# EAGLE design DC-DC (EAGLE 7.6.0)
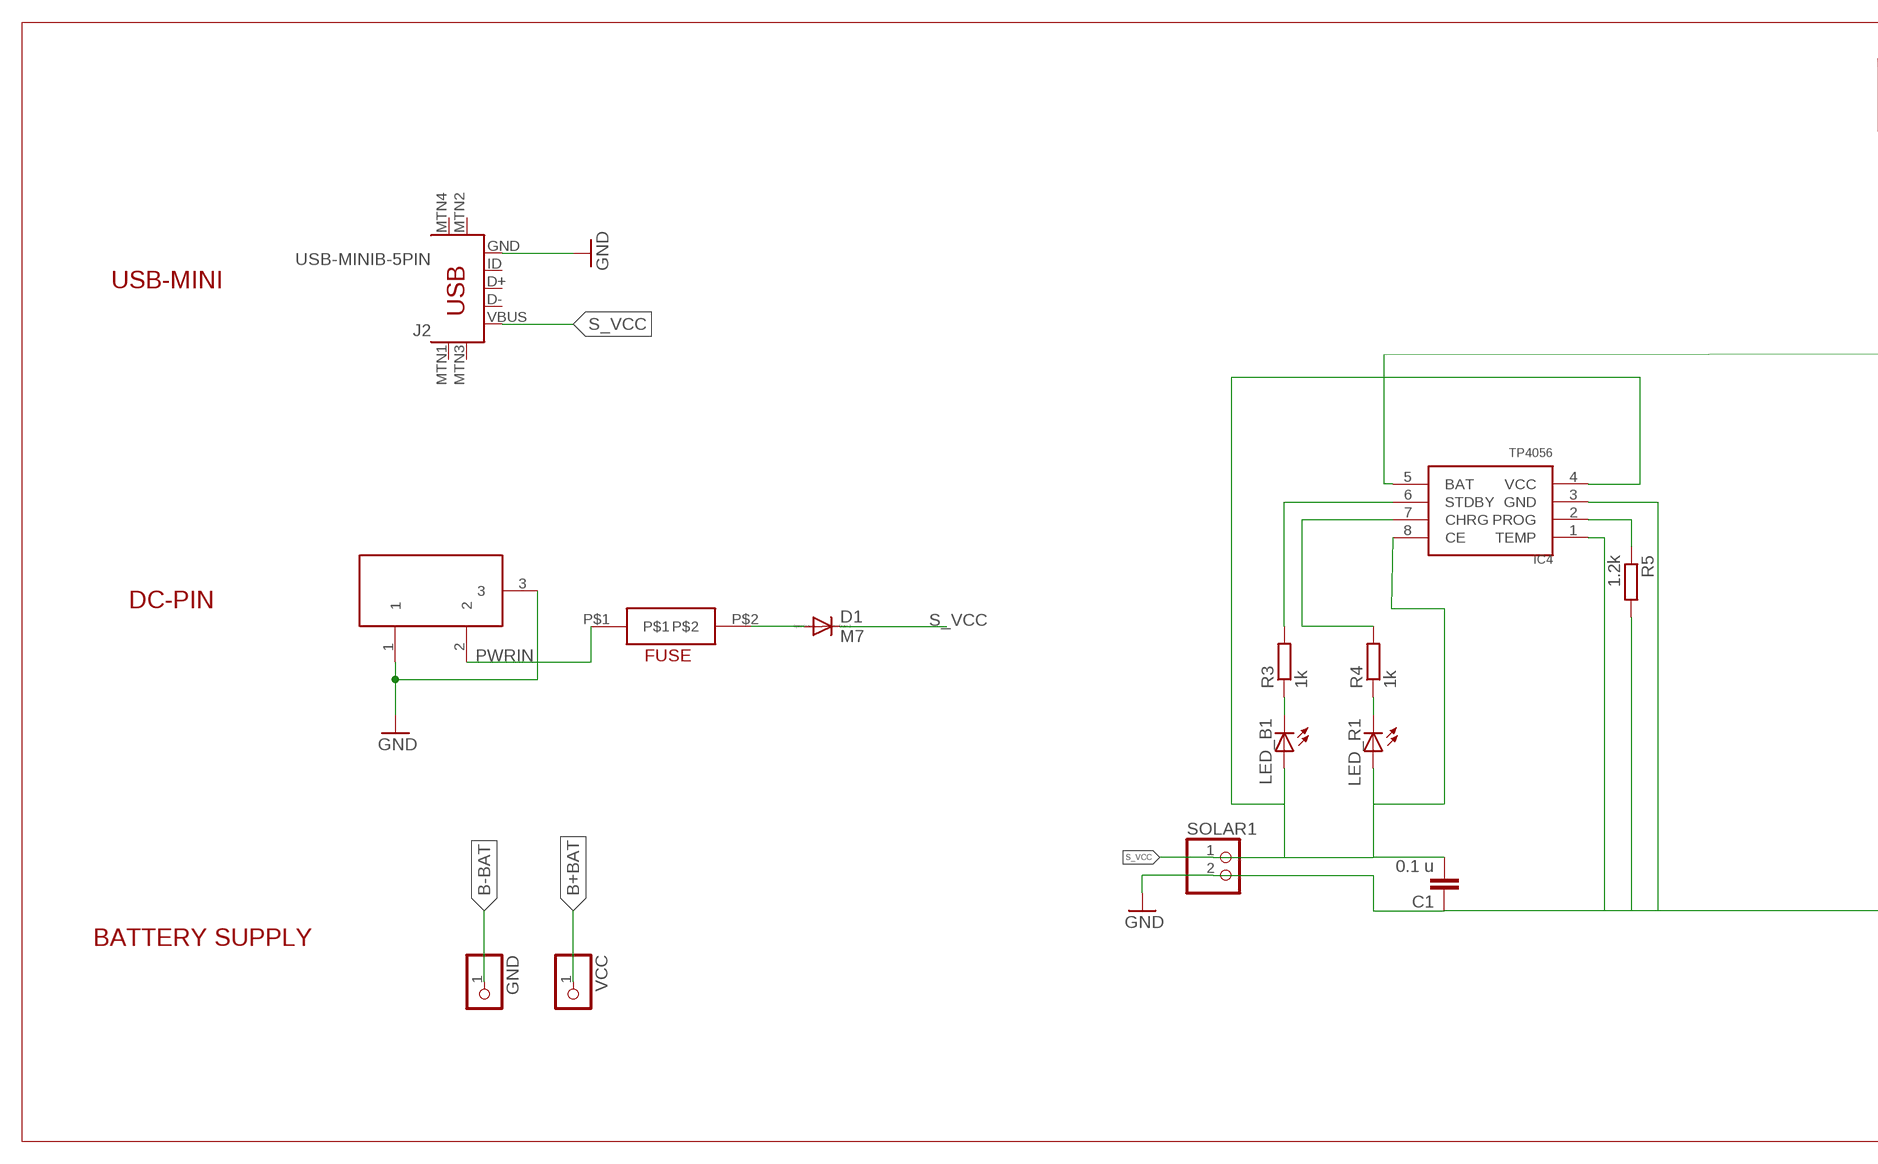
[diagram p0: schematic, sheet 1, part 1 of 2]
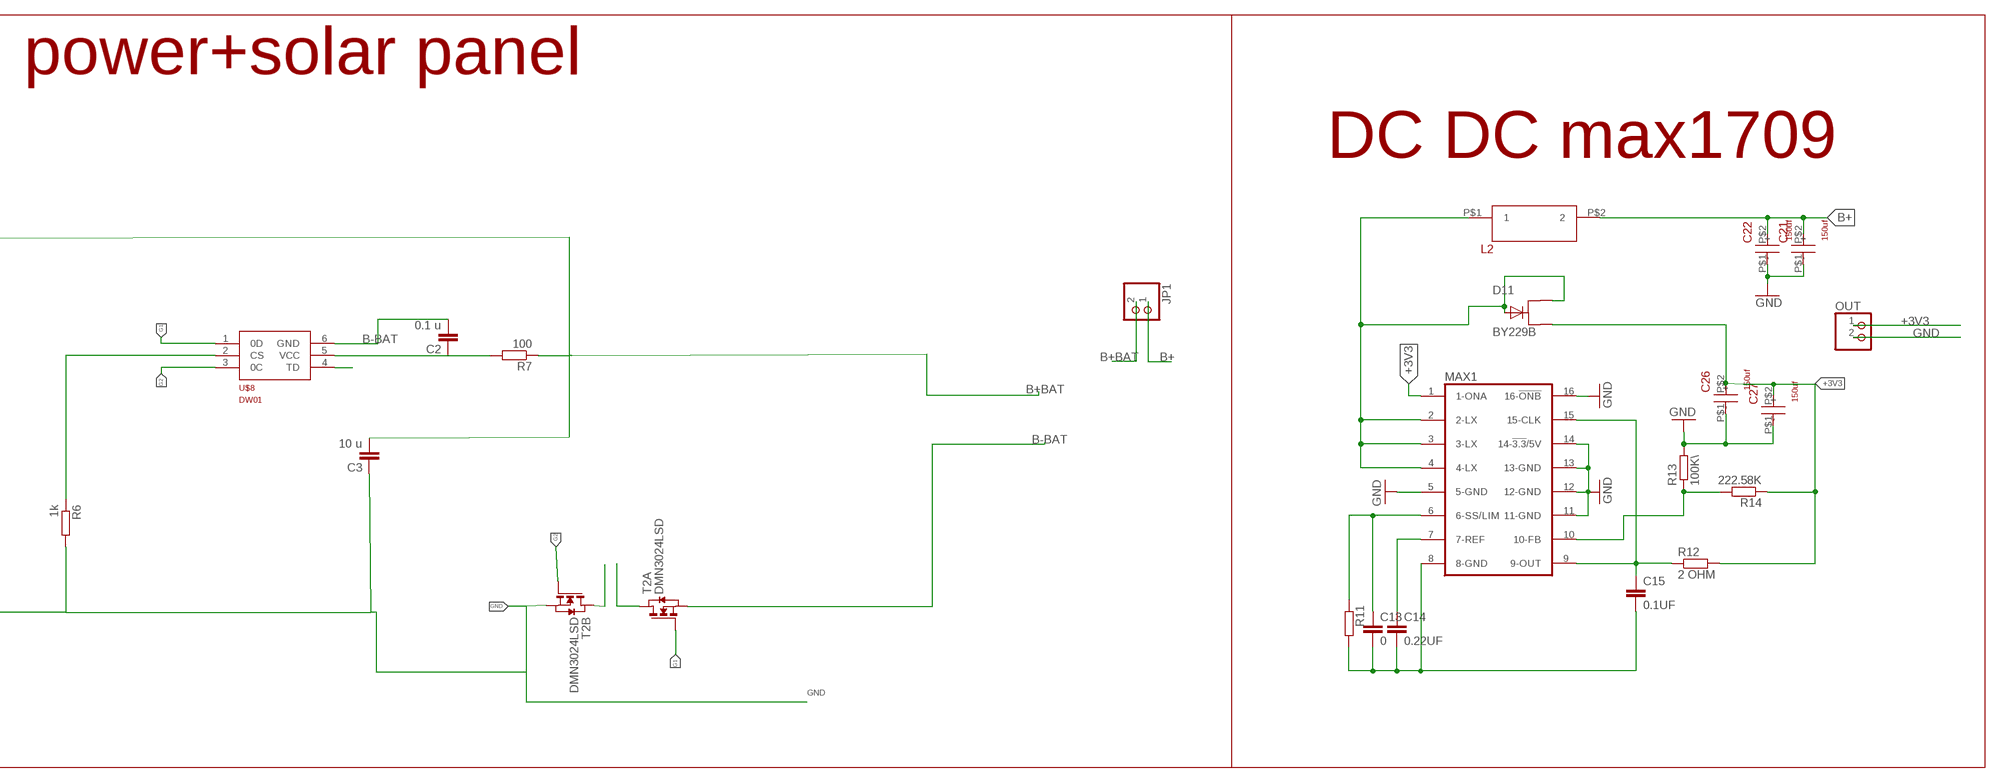
[diagram p1: schematic, sheet 1, part 2 of 2]

## Parts
C1  0.1 u  C-EUC0805  [C0805]
C2  0.1 u  C-EUC0805  [C0805]
C3  10 u  C-EUC0805  [C0805]
C13  0  C-EUC0805  [C0805]
C14  0.22UF  C-EUC0805  [C0805]
C15  0.1UF  C-EUC0805  [C0805]
C21  150uf  MOSHE_CAP  [CAP]
C22  150uf  MOSHE_CAP  [CAP]
C26  150uf  MOSHE_CAP  [CAP]
C27  150uf  MOSHE_CAP  [CAP]
D1  M7  DIODE-SMB  [SMB]
D11  BY229B  [TO263AB]
GND  PINHD-1X1  [1X01]
IC4  TP4056  [SOP-8]
J2  USB-MINIB-5PIN  [USB-MINIB]
JP1  PINHD-1X2  [1X02]
L2  INDUCTOR  [INDUCTOR_150]
LED_B1  LEDCHIP-LED0805  [CHIP-LED0805]
LED_R1  LEDCHIP-LED0805  [CHIP-LED0805]
MAX1  MOSHE_MAX1709F  [MAX1709]
OUT  PINHD-1X2  [1X02]
R3  1k  R-EU_R0805  [R0805]
R4  1k  R-EU_R0805  [R0805]
R5  1.2k  R-EU_R0805  [R0805]
R6  1k  R-EU_R0805  [R0805]
R7  100  R-EU_R0805  [R0805]
R11  R-EU_R0805  [R0805]
R12  2 OHM  R-EU_R0805  [R0805]
R13  100K\  R-EU_R0805  [R0805]
R14  222.58K  R-EU_R0805  [R0805]
SOLAR1  PINHD-1X2  [1X02]
T2  DMN3024LSD  [TSSOP-8]
U$5  FUSE_M  [DIP2]
U$8  DW01  [SOT23-6]
VCC  PINHD-1X1  [1X01]
X1  DC21MMX  [DC-21MM]

## Nets
+3V3: C26.P$2(-) C27.P$2(-) D11.K MAX1.1(1-ONA) OUT.1 R12.2 R14.1
B+: C21.P$2(-) C22.P$2(-) JP1.1 L2.P$2
B+BAT: C3.2 IC4.5(BAT) JP1.2 R7.1 VCC.1
B-BAT: C2.2 GND.1 T2.2(A:S) T2.3(A:S) U$8.6(GND)
G1: T2.4(A:G) U$8.1(0D)
G2: T2.5(B:G) U$8.3(0C)
GND: C1.1 C3.1 C13.2 C14.2 C15.2 C21.P$1(+) C22.P$1(+) C26.P$1(+) C27.P$1(+) IC4.1(TEMP) IC4.3(GND) J2.GND MAX1.5(5-GND) MAX1.8(8-GND) MAX1.11(11-GND) MAX1.12(12-GND) MAX1.13(13-GND) MAX1.14(14-!3.3!/5V) MAX1.16(16-!ONB!) OUT.2 R5.2 R6.2 R11.2 R13.2 SOLAR1.2 T2.6(B:S) T2.7(B:S) X1.1 X1.3
N$3: LED_B1.C R3.1
N$4: LED_R1.C R4.1
N$5: D1.A U$5.P$2
N$10: IC4.6(STDBY) R3.2
N$12: C13.1 MAX1.6(6-SS/LIM) R11.1
N$13: C14.1 MAX1.7(7-REF)
N$23: IC4.7(CHRG) R4.2
N$24: IC4.2(PROG) R5.1
N$29: U$8.4(TD)
N$30: R6.1 U$8.2(CS)
N$36: C2.1 R7.2 U$8.5(VCC)
N$39: T2.8(B:D)
N$40: T2.1(A:D)
N$42: C15.1 MAX1.9(9-OUT) MAX1.15(15-CLK) R12.1
N$43: MAX1.10(10-FB) R13.1 R14.2
N$44: D11.1 D11.2 L2.P$1 MAX1.2(2-LX) MAX1.3(3-LX) MAX1.4(4-LX)
PWRIN: U$5.P$1 X1.2
S_VCC: C1.2 D1.C IC4.4(VCC) IC4.8(CE) J2.VBUS LED_B1.A LED_R1.A SOLAR1.1
Unconnected: J2.D+ J2.D- J2.ID J2.MTN1(MTN2) J2.MTN2(MTN3) J2.MTN3(MTN1) J2.MTN4

## Notes on the sheet
- power+solar panel
- DC DC max1709
- USB-MINI
- DC-PIN
- BATTERY SUPPLY

## Library data of the parts
C1-C3 C13-C15 = rcl:C-EU: CAPACITOR, European symbol
C21 C22 C26 C27 = tantalum capacitor:MOSHE_CAP
D1 = diode:DIODE-: DIODE
D11 = diode:BY229B: DIODE Fast Switching Rectifier, 8A (Vishay)
GND VCC = pinhead:PINHD-1X1: PIN HEADER
IC4 = TP4056:TP4056
J2 = SparkFun-Connectors:USB-MINIB: Mini-USB "B" connector with 5th pin broken out. Created new symbol breaking out 5th "ID" pin in mini/micro USB connector spec. See: http://en.wikipedia.org/wiki/Mini_usb#Cables. Uses same footprint as 4-pin symbol. Also added pins to connect to mounting / shield pads if required (probably not generally needed as signals aren't shielded once they leave the connector).; PROD_ID: CONN-08193
JP1 OUT SOLAR1 = pinhead:PINHD-1X2: PIN HEADER
L2 = MOSHE_DIODE.SS54:INDUCTOR
LED_B1 LED_R1 = adafruit:LED: LED OSRAM: - CHIPLED LG R971, LG N971, LY N971, LG Q971, LY Q971, LO R971, LY R971 LH N974, LH R974 LS Q976, LO Q976, LY Q976 LO Q996 - Hyper CHIPLED LW Q18S LB Q993, LB Q99A, LB R99A - SideLED LS A670, LO A670, LY A670, LG A670, LP A670 LB A673, LV A673, LT A673, LW A673 LH A674 LY A675 LS A676, LA A676, LO A676, LY A676, LW A676 LS A679, LY A679, LG A679 - Hyper Micro SIDELED® LS Y876, LA Y876, LO Y876, LY Y876 LT Y87S - SmartLED LW L88C, LW L88S LB L89C, LB L89S, LG L890 LS L89K, LO L89K, LY L89K LS L896, LA L896, LO L896, LY L896 - TOPLED LS T670, LO T670, LY T670, LG T670, LP T670 LSG T670, LSP T670, LSY T670, LOP T670, LYG T670 LG T671, LOG T671, LSG T671 LB T673, LV T673, LT T673, LW T673 LH T674 LS T676, LA T676, LO T676, LY T676, LB T676, LH T676, LSB T676, LW T676 LB T67C, LV T67C, LT T67C, LS T67K, LO T67K, LY T67K, LW E67C LS E67B, LA E67B, LO E67B, LY E67B, LB E67C, LV E67C, LT E67C LW T67C LS T679, LY T679, LG T679 LS T770, LO T770, LY T770, LG T770, LP T770 LB T773, LV T773, LT T773, LW T773 LH T774 LS E675, LA E675, LY E675, LS T675 LS T776, LA T776, LO T776, LY T776, LB T776 LHGB T686 LT T68C, LB T68C - Hyper Mini TOPLED® LB M676 - Mini TOPLED Santana® LG M470 LS M47K, LO M47K, LY M47K Source: http://www.osram.convergy.de/
MAX1 = MOSHE_MAX1709F:MOSHE_MAX1709F
R3-R7 R11-R14 = resistor:R-EU_: RESISTOR, European symbol
T2 = FS8205A:DMN3024LSD: DUAL N-CHANNEL ENHANCEMENT MODE MOSFET data sheet <http://goo.gl/dRgboR> Dave.Calaway Eagle Library <https://goo.gl/Muy1Tr>
U$5 = FUSE_M:FUSE_M
U$8 = DW01:DW01: The DW01-P battery protection IC is designed to protect lithium-ion/polymer battery from damage or degrading the lifetime due to overcharge, overdischarge, and/or overcurrent for one-cell lithium-ion/polymer battery powered systems, such as cellular phones. Data sheet <http://goo.gl/4y108d> Dave.Calaway Eagle Library <https://goo.gl/Muy1Tr>
X1 = powersupply:DC21MM

## Board
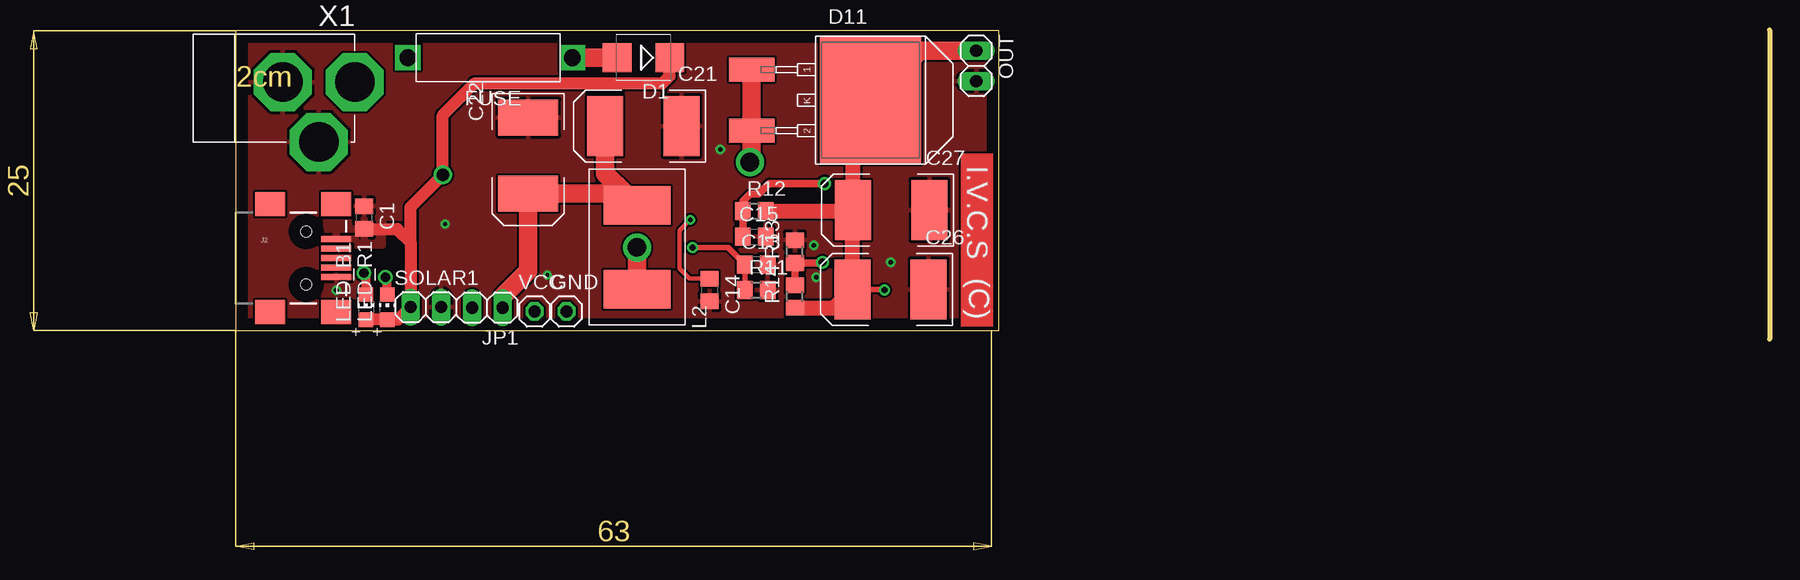
[diagram p2: board, top side]
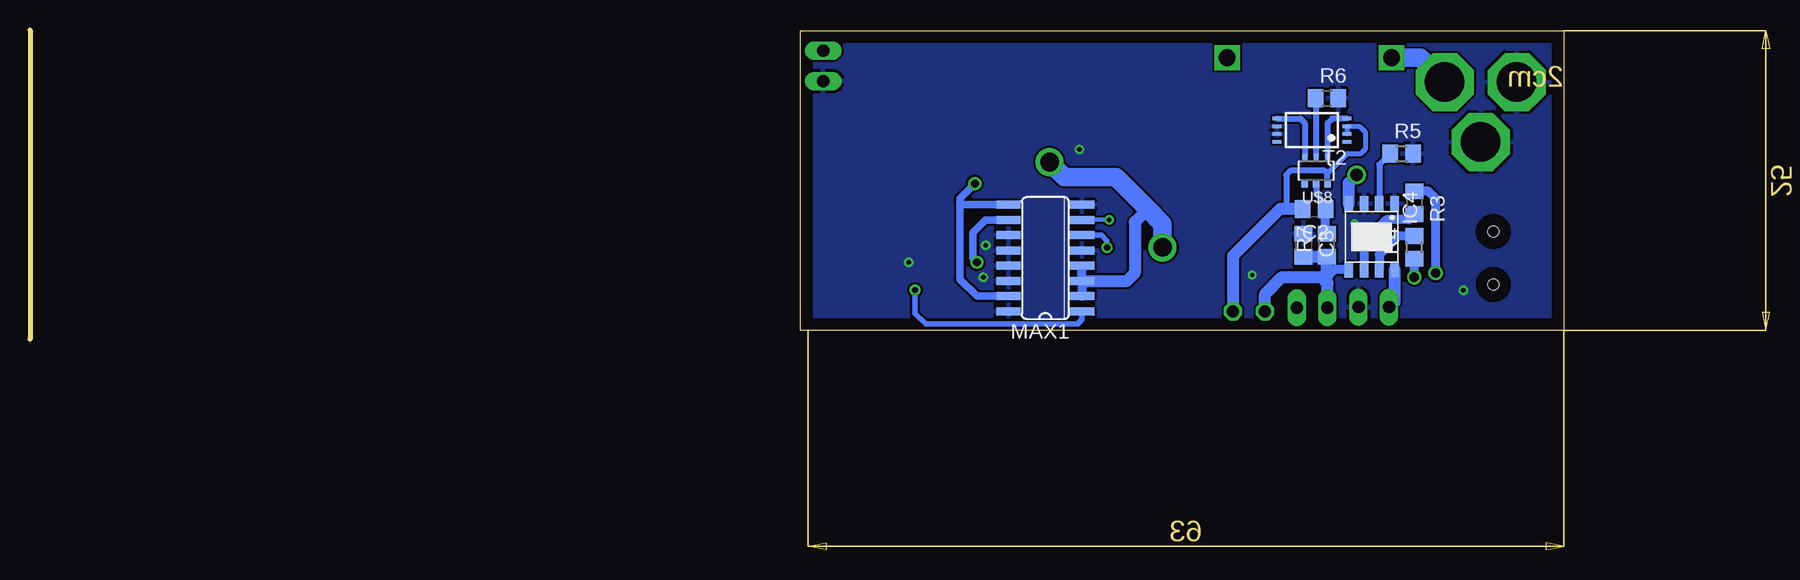
[diagram p3: board, bottom side, seen from below]

Size 127.84 x 25.78 mm. Coordinates in mm from the lower left corner, seen from the top.
Outline: 127.84,25.78 127.84,0
Outline: 0,0.71 63.59,0.71 63.59,25.7 0,25.7 0,0.71
Copper layers (1*16): Top 0.035mm / dielectric 1.5mm / Bottom 0.035mm
Design rules "default *": minimum track width 10mil, minimum drill 13mil, track to track 7mil, track to pad 7mil, pad to pad 7mil, via to via 7mil, smd to smd 7mil, copper to edge 40mil, drill to drill 8mil, minimum pad ring 10mil, minimum via ring 8mil, stop-mask expansion 4mil, vias tented up to drill 0mil, thermal gap 10mil

### Footprints (pad centres in the part's own frame; a part is rotated, then mirrored left to right if it is on the bottom)
C0805 = smd 1.3 x 1.5: 1 -0.95,0; 2 0.95,0
CAP = smd 3 x 5: P$1 -3,0; P$2 3.349,0
SMB = smd 2.4 x 2.4: A 2.2,0; C -2.2,0
TO263AB = smd 2.032 x 3.81: 1 -2.54,0; 2 2.54,0 | smd 10.668 x 8.382: K 0,9.906
1X01 = drill 1.016 octagon: 1 0,0
SOP-8 = smd 1.3 x 0.7: 1 -2.75,1.905; 2 -2.75,0.635; 3 -2.75,-0.635; 4 -2.75,-1.905; 5 2.75,-1.905; 6 2.75,-0.635; 7 2.75,0.635; 8 2.75,1.905
USB-MINIB = smd 2.5 x 0.5: D+ 2.5,0; D- 2.5,0.8; GND 2.5,-1.6; ID 2.5,-0.8; VBUS 2.5,1.6 | smd 2.5 x 2: MTN1 -3,4.5; MTN2 2.5,4.5; MTN3 -3,-4.5; MTN4 2.5,-4.5 | hole 0.9: 0,2.2; 0,-2.2
1X02 = drill 1.016 long: 1 -1.27,0; 2 1.27,0
INDUCTOR_150 = smd 3.2 x 5.6: P$1 -3.03,-0.54; P$2 3.97,-0.54
CHIP-LED0805 = smd 1.2 x 1.2: A 0,-1.05; C 0,1.05
MAX1709 = smd 0.66 x 2.032: 1 -4.445,-3.073; 2 -3.175,-3.073; 3 -1.905,-3.073; 4 -0.635,-3.073; 5 0.635,-3.073; 6 1.905,-3.073; 7 3.175,-3.073; 8 4.445,-3.073; 9 4.445,3.073; 10 3.175,3.073; 11 1.905,3.073; 12 0.635,3.073; 13 -0.635,3.073; 14 -1.905,3.073; 15 -3.175,3.073; 16 -4.445,3.073
R0805 = smd 1.3 x 1.5: 1 -0.95,0; 2 0.95,0
TSSOP-8 = smd 0.3 x 0.75: 1 -0.975,-2.925; 2 -0.325,-2.925; 3 0.325,-2.925; 4 0.975,-2.925; 5 0.975,2.925; 6 0.325,2.925; 7 -0.325,2.925; 8 -0.975,2.925
DIP2 = drill 1.4 square: P$1 -7.35,0; P$2 6.35,0
SOT23-6 = smd 0.4 x 0.55: 1 -0.95,-1.15; 2 0,-1.15; 3 0.95,-1.15 | smd 0.55 x 0.55: 4 0.95,1.15; 5 0,1.15; 6 -0.95,1.15
DC-21MM = drill 3.302 pad 4.826 octagon: 1 -5.08,-3.353; 2 -0.076,-6.35; 3 -0.076,-0.356

### Placement (x,y rotation side)
C1  10.67,10.13 270 top
C2  20.8,10.85 180 bottom
C3  21.69,7.82 270 bottom
C13  43.38,6.22 0 top
C14  39.47,4.09 270 top
C15  43.21,8.53 0 top
C21  34.14,17.78 180 top
C22  24.36,15.47 270 top
C26  54.74,4.14 180 top
C27  54.79,10.77 180 top
D1  33.96,23.47 180 top
D11  42.99,19.93 270 top
GND  27.56,2.31 0 top
IC4  16,8.53 270 bottom
J2  5.87,6.76 0 top
JP1  20.95,2.62 180 top
L2  32.89,7.19 90 top
LED_B1  10.85,2.67 0 top
LED_R1  12.62,2.67 0 top
MAX1  43.21,6.76 90 bottom
OUT  61.72,22.78 270 top
R3  12.45,11.38 270 bottom
R4  12.45,7.65 90 bottom
R5  13.51,15.47 0 bottom
R6  19.74,20.09 0 bottom
R7  19.74,7.82 90 bottom
R11  43.38,4.09 0 top
R12  43.21,10.67 0 top
R13  46.58,7.29 90 top
R14  46.58,3.56 90 top
SOLAR1  15.82,2.67 0 top
T2  20.98,17.42 90 bottom
U$5  21.69,23.47 0 top
U$8  20.62,14.05 180 bottom
VCC  24.89,2.31 0 top
X1  3.56,21.51 90 top

### Tracks (layer width: path | path; a pad name or v marks a point on that pad's centre or on a via)
+3V3  (via drill 0.51)
  Top 0.457: v54.05,4.09 54,4.14 C26.P$2
  Top 1.27: 51.44,11.74 C27.P$2 51.39,10.72 C26.P$2 49.86,2.61 R14.1 | 51.44,11.74 51.44,17.76 D11.K | R12.2 50.38,10.67 51.44,11.74
  Top 1.524: D11.K 57.02,24.05 OUT.1
  Bottom 0.457: MAX1.1 40.13,1.65 40.54,1.24 53.16,1.24 54.05,2.13 v54.05,4.09
B+
  Top 1.524: 32.47,12.12 C22.P$2 24.36,5.69 22.23,3.56 JP1.1 | 32.47,12.12 L2.P$2 | 32.47,12.12 30.79,13.8 C21.P$2
B+BAT
  Bottom 0.762: IC4.5 19.11,5.78 19.74,5.16
  Bottom 1.016: C3.2 R7.1 19.74,5.16 20.19,5.16 | VCC.1 24.89,3.73 23.47,5.16 20.19,5.16 | JP1.2 19.68,4.65 20.19,5.16
B-BAT
  Bottom 0.406: T2.2 T2.3 17.04,17.75 16.54,17.25 16.54,15.82 16.89,15.47 18.01,15.47 19.68,13.81
  Bottom 0.508: U$8.6 19.68,13.81 19.91,14.05 22.76,14.05 23.11,13.69 23.11,11.02 23.29,10.85
  Bottom 1.016: C2.2 23.29,10.85 23.65,10.85 27.56,6.93 GND.1
G1
  Bottom 0.508: T2.4 19.29,18.4 19.68,18.02 U$8.1
G2
  Bottom 0.508: T2.5 21.95,18.4 21.57,18.02 U$8.3
GND  (via drill 0.33, 0.38)
  other vias: 40.36,15.82 48.36,5.16 54.58,6.4 8.36,4.09 17.42,9.6 25.96,5.33 48.18,7.82
  pour Top: 0.18,25.6 0.18,1.07 63.47,0.89 63.47,25.43
  pour Bottom: 0.18,25.6 63.47,25.6 63.47,0.89 0.18,0.89
N$3  (via drill 0.79)
  Top 0.762: LED_B1.C 10.85,5.33 v10.67,5.51
  Bottom 0.762: v10.67,5.51 10.67,11.74 11.26,12.33 R3.1
N$4  (via drill 0.79)
  Top 0.762: LED_R1.C 12.62,4.98 v12.45,5.16
  Bottom 0.762: v12.45,5.16 R4.1
N$5
  Top 1.524: D1.A U$5.P$2
N$10
  Bottom 0.762: R3.2 12.92,9.96 14.76,9.96 16.64,8.08 IC4.6
N$12  (via drill 0.51)
  Top 0.457: R11.1 C13.1 41.01,7.65 v38.05,7.65
  Bottom 0.457: MAX1.6 38.53,8.66 38.05,8.18 v38.05,7.65
N$13  (via drill 0.38)
  Top 0.356: v37.87,9.96 36.98,9.07 36.98,5.87 37.8,5.05 39.46,5.05 C14.1
  Bottom 0.356: v37.87,9.96 40.11,9.96 MAX1.7
N$23
  Bottom 0.762: IC4.7 15.37,7.04 13.81,8.6 R4.2
N$24
  Bottom 0.508: R5.1 15.37,14.56 IC4.2
N$30
  Bottom 0.508: U$8.2 20.62,20.03 R6.1
N$36
  Bottom 0.508: U$8.5 20.62,12.09 19.85,11.32 C2.1
  Bottom 0.762: R7.2 19.85,8.89 C2.1
N$42  (via drill 0.69)
  Top 0.635: C15.1 R12.1 42.26,11.5 42.85,12.09 43.56,12.09 44.45,12.98 v49.07,12.98
  Bottom 0.635: MAX1.15 48.92,3.58 50.32,4.98 50.32,11.38 | MAX1.9 50.14,11.2 50.32,11.38 | v49.07,12.98 50.32,11.74 50.32,11.38
N$43  (via drill 0.65)
  Top 0.635: R14.2 R13.1 48.83,6.34 v48.9,6.4
  Bottom 0.635: MAX1.10 48.21,9.93 49.25,8.89 49.25,6.76 v48.9,6.4
N$44  (via drill 1.55)
  Top 1.524: L2.P$1 v33.43,7.65 | 43.74,17.35 D11.2 | v42.85,14.76 42.99,14.9 D11.2 | D11.2 D11.1
  Bottom 0.762: MAX1.4 MAX1.3 MAX1.2
  Bottom 1.016: MAX1.3 36.4,4.85 35.74,5.51 35.74,9.78 34.67,10.85
  Bottom 1.524: v33.43,7.65 33.43,9.6 34.67,10.85 37.34,13.51 41.6,13.51 v42.85,14.76
PWRIN
  Bottom 1.524: X1.2 11.94,23.47 U$5.P$1
S_VCC  (via drill 1.03)
  Top 1.016: LED_B1.A LED_R1.A 13.5,1.62 SOLAR1.1 14.55,8.08 | C1.2 13.45,9.18 14.55,8.08 | 14.55,8.08 14.55,11 v17.25,13.69 17.25,18.67 19.91,21.34 35.56,21.34 36.16,21.94 D1.C
  Bottom 1.016: IC4.8 14.1,3.12 SOLAR1.1 | IC4.4 17.91,13.03 v17.25,13.69
  pour Top (isolate 0.254): 6.76,7.82 12.19,7.8 12.22,10.34 6.78,10.36
(copper drawn outside any net)
  shapes: Top area x1

### Text on the board
Dimension: 2cm
tPlace: I.V.C.S | (C) | I.V.C.S | (C)